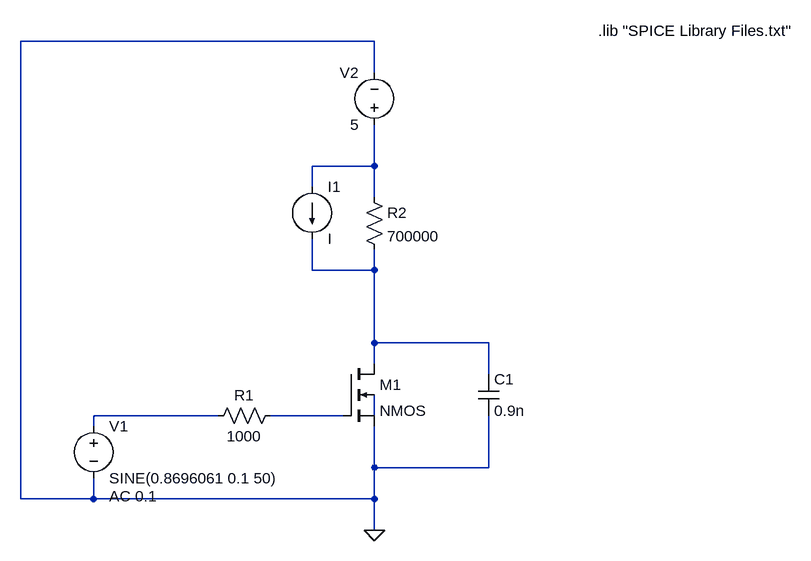
[diagram p0: schematic CSA with Current Source.asc]
CSA with Current Source.asc, the LTspice schematic file:
Version 4
SHEET 1 880 680
WIRE -208 -288 -752 -288
WIRE -208 -240 -208 -288
WIRE -208 -96 -208 -160
WIRE -208 -96 -304 -96
WIRE -304 -64 -304 -96
WIRE -208 -48 -208 -96
WIRE -304 64 -304 16
WIRE -208 64 -208 32
WIRE -208 64 -304 64
WIRE -208 176 -208 64
WIRE -32 176 -208 176
WIRE -208 208 -208 176
WIRE -32 224 -32 176
WIRE -448 288 -640 288
WIRE -256 288 -368 288
WIRE -208 288 -208 256
WIRE -640 304 -640 288
WIRE -208 368 -208 304
WIRE -32 368 -32 288
WIRE -32 368 -208 368
WIRE -752 416 -752 -288
WIRE -640 416 -640 384
WIRE -640 416 -752 416
WIRE -208 416 -208 368
WIRE -208 416 -640 416
WIRE -208 464 -208 416
FLAG -208 464 0
SYMBOL nmos4 -256 208 R0
SYMATTR InstName M1
SYMATTR Value2 l=0.6u w=3u
SYMBOL voltage -640 288 R0
WINDOW 123 24 124 Left 2
WINDOW 39 0 0 Left 0
SYMATTR Value2 AC 0.1
SYMATTR InstName V1
SYMATTR Value SINE(0.8696061 0.1 50)
SYMBOL res -352 272 R90
WINDOW 0 0 56 VBottom 2
WINDOW 3 32 56 VTop 2
SYMATTR InstName R1
SYMATTR Value 1000
SYMBOL voltage -208 -144 R180
WINDOW 0 24 96 Left 2
WINDOW 3 24 16 Left 2
WINDOW 123 0 0 Left 0
WINDOW 39 0 0 Left 0
SYMATTR InstName V2
SYMATTR Value 5
SYMBOL res -224 -64 R0
SYMATTR InstName R2
SYMATTR Value 700000
SYMBOL current -304 -64 R0
SYMATTR InstName I1
SYMBOL cap -48 224 R0
SYMATTR InstName C1
SYMATTR Value 0.9n
TEXT 136 -304 Left 2 !.lib "SPICE Library Files.txt"

The netlist it stands for:
* CSA with Current Source.asc
M1 N002 N004 0 N005 NMOS l=0.6u w=3u
V1 N003 0 SINE(0.8696061 0.1 50) AC 0.1
R1 N004 N003 1000
V2 N001 0 5
R2 N001 N002 700000
I1 N001 N002 I
C1 N002 0 0.9n
.model NMOS NMOS
.model PMOS PMOS
.lib standard.mos
.lib "SPICE Library Files.txt"
.backanno
.end